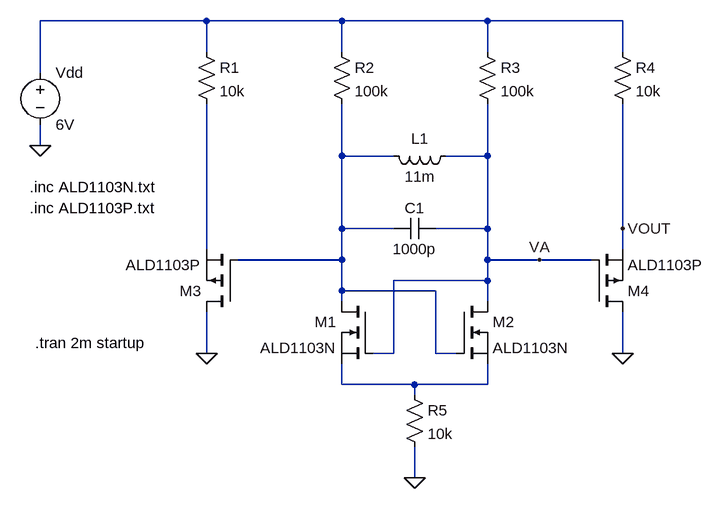
[diagram p0: schematic prelab.asc]
prelab.asc, the LTspice schematic file:
Version 4.1
SHEET 1 1108 680
WIRE 320 -192 64 -192
WIRE 528 -192 320 -192
WIRE 752 -192 528 -192
WIRE 960 -192 752 -192
WIRE 320 -144 320 -192
WIRE 528 -144 528 -192
WIRE 752 -144 752 -192
WIRE 960 -144 960 -192
WIRE 64 -112 64 -192
WIRE 64 0 64 -32
WIRE 528 16 528 -64
WIRE 608 16 528 16
WIRE 752 16 752 -64
WIRE 752 16 688 16
WIRE 528 128 528 16
WIRE 608 128 528 128
WIRE 752 128 752 16
WIRE 752 128 672 128
WIRE 960 128 960 -64
WIRE 320 160 320 -64
WIRE 960 160 960 128
WIRE 528 176 528 128
WIRE 528 176 368 176
WIRE 752 176 752 128
WIRE 832 176 752 176
WIRE 912 176 832 176
WIRE 752 208 752 176
WIRE 752 208 608 208
WIRE 528 224 528 176
WIRE 672 224 528 224
WIRE 528 240 528 224
WIRE 752 240 752 208
WIRE 320 320 320 256
WIRE 608 320 608 208
WIRE 608 320 576 320
WIRE 672 320 672 224
WIRE 704 320 672 320
WIRE 960 320 960 256
WIRE 528 368 528 336
WIRE 640 368 528 368
WIRE 752 368 752 336
WIRE 752 368 640 368
WIRE 640 384 640 368
WIRE 640 512 640 464
FLAG 64 0 0
FLAG 320 320 0
FLAG 960 320 0
FLAG 832 176 VA
FLAG 960 128 VOUT
FLAG 640 512 0
SYMBOL voltage 64 -128 R0
SYMATTR InstName Vdd
SYMATTR Value 6V
SYMBOL res 304 -160 R0
SYMATTR InstName R1
SYMATTR Value 10k
SYMBOL res 512 -160 R0
SYMATTR InstName R2
SYMATTR Value 100k
SYMBOL res 736 -160 R0
SYMATTR InstName R3
SYMATTR Value 100k
SYMBOL res 944 -160 R0
SYMATTR InstName R4
SYMATTR Value 10k
SYMBOL ind 704 0 R90
WINDOW 0 5 56 VBottom 2
WINDOW 3 32 56 VTop 2
SYMATTR InstName L1
SYMATTR Value 11m
SYMBOL cap 672 112 R90
WINDOW 0 0 32 VBottom 2
WINDOW 3 32 32 VTop 2
SYMATTR InstName C1
SYMATTR Value 1000p
SYMBOL nmos 576 240 M0
SYMATTR InstName M1
SYMATTR Value ALD1103N
SYMBOL nmos 704 240 R0
SYMATTR InstName M2
SYMATTR Value ALD1103N
SYMBOL pmos 368 256 R180
SYMATTR InstName M3
SYMATTR Value ALD1103P
SYMBOL pmos 912 256 M180
SYMATTR InstName M4
SYMATTR Value ALD1103P
SYMBOL res 624 368 R0
SYMATTR InstName R5
SYMATTR Value 10k
TEXT 48 64 Left 2 !.inc ALD1103N.txt
TEXT 48 96 Left 2 !.inc ALD1103P.txt
TEXT 56 304 Left 2 !.tran 2m startup

The netlist it stands for:
* prelab.asc
Vdd N001 0 6V
R1 N001 N003 10k
R2 N001 N002 100k
R3 N001 VA 100k
R4 N001 VOUT 10k
L1 VA N002 11m
C1 VA N002 1000p
M1 N002 VA N004 N004 ALD1103N
M2 VA N002 N004 N004 ALD1103N
M3 0 N002 N003 N003 ALD1103P
M4 0 VA VOUT VOUT ALD1103P
R5 N004 0 10k
.model NMOS NMOS
.model PMOS PMOS
.lib standard.mos
.inc ALD1103N.txt
.inc ALD1103P.txt
.tran 2m startup
.backanno
.end

* Results of the author's LTspice run, read from the files saved beside the schematic
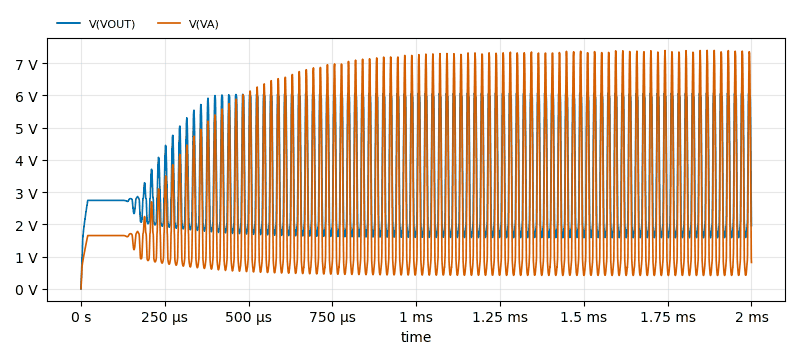
[diagram p1: Transient Analysis of prelab.asc, plotted from the saved traces]
* Transient Analysis, 1 run:
*   V(VOUT): min 0 V, max 6.061 V, average 3.353 V, rms 3.77 V, last 1.962 V
*   V(VA): min 0 V, max 7.392 V, average 2.594 V, rms 3.478 V, last 816.3 mV